# Altium schematic sheet UART_to_Micro_USB.SchDoc
size A4; Organization: Altium Limited; Address1: L3, 12a Rodborough Rd; Address2: Frenchs Forest; Address3: NSW; Address4: Australia 2086
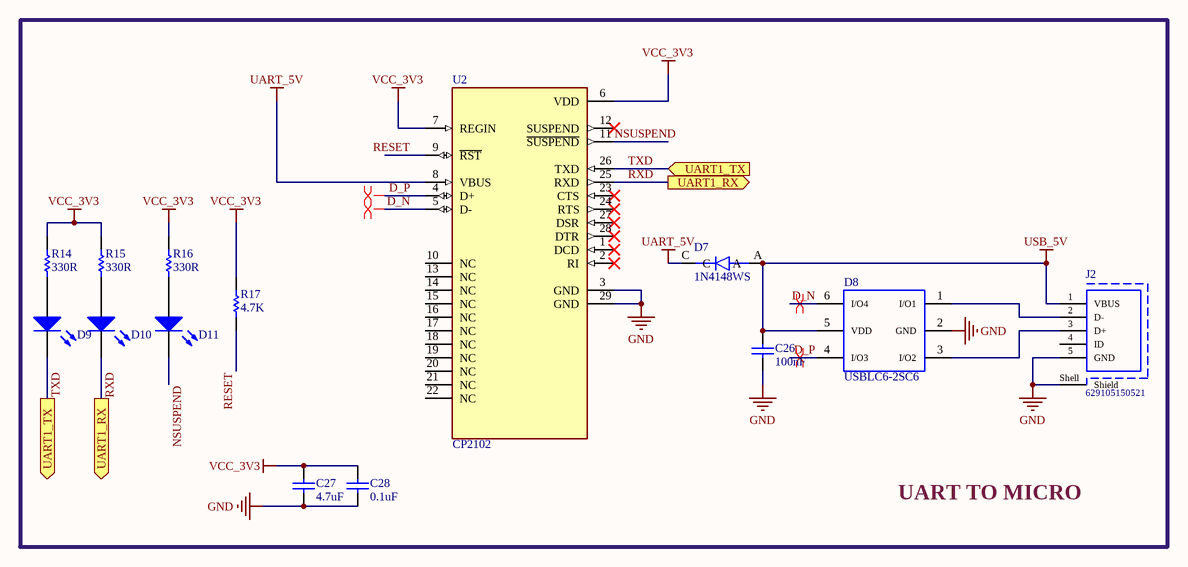
[diagram p0: UART_to_Micro_USB.SchDoc]

## Parts
C26  value 100nF  [CAP-SM-0805]  (hidden comment: Cap Non-Pol SMD)
C27  value 4.7uF  [CAP-SM-0805]  (hidden comment: Cap Non-Pol SMD)
C28  value 0.1uF  [CAP-SM-0805]  (hidden comment: Cap Non-Pol SMD)
D7  1N4148WS  [SODFL2512X100N]
D8  USBLC6-2SC6  [WE-TVS_SOT23-6L]
D9  LED SMD  [LED_0603_Blue]  (value not drawn)
D10  LED SMD  [LED_0603_Blue]  (value not drawn)
D11  LED SMD  [LED_0603_Blue]  (value not drawn)
J2  629105150521  [629105150521]
R14  value 330R  [RES-SM-0805]  (hidden comment: RESISTOR SMD)
R15  value 330R  [RES-SM-0805]  (hidden comment: RESISTOR SMD)
R16  value 330R  [RES-SM-0805]  (hidden comment: RESISTOR SMD)
R17  value 4.7K  [RES-SM-0805]  (hidden comment: RESISTOR SMD)
U2  CP2102  [QFN50P500X500X100-29N]

## Blocks framed on the sheet
UART TO MICRO: C26-C28 D7-D11 J2 R14-R17 U2

## Ports
UART1_RX (out), UART1_TX (in), UART1_TX (out)

## Nets
GND: C26.1 C27.1 C28.1 D8.2(GND) J2.5(GND) J2.Shell(Shield) U2.3(GND) U2.29(GND)
UART_5V: D7.C U2.8(VBUS)
USB_5V: C26.2 D7.A D8.5(VDD) J2.1(VBUS)
VCC_3V3: C27.2 C28.2 R14.2 R15.2 R16.2 R17.1 U2.6(VDD) U2.7(REGIN)
D_N: D8.6(I/O4) U2.5(D-)
D_P: D8.4(I/O3) U2.4(D+)
NSUSPEND: D11.2(K) U2.11(~{SUSPEND})
RESET: R17.2 U2.9(~{RST})
RXD: D10.2(K) U2.25(RXD) ; port UART1_RX
TXD: D9.2(K) U2.26(TXD) ; port UART1_TX
NetD8_1: D8.1(I/O1) J2.2(D-)
NetD8_3: D8.3(I/O2) J2.3(D+)
NetD9_1: D9.1(A) R14.1
NetD10_1: D10.1(A) R15.1
NetD11_1: D11.1(A) R16.1

Not connected (* = marked no-connect by the designer): J2 4(ID); U2 1(DCD)* 2(RI)* 10(NC) 12(SUSPEND)* 13(NC) 14(NC) 15(NC) 16(NC) 17(NC) 18(NC) 19(NC) 20(NC) 21(NC) 22(NC) 23(CTS)* 24(RTS)* 27(DSR)* 28(DTR)*

## Layout directives
differential pair: D_N, D_P

## Notes on the sheet
- Title
- Size:
- Date:
- A4
- Number:
- Time:
- Revision:
- Sheet
- of
- File:

## Library data of the parts
C26-C28 = Cap Non-Pol SMD: Capacitor
D7 = 1N4148WS: Diode Standard 75V 300mA (DC) Surface Mount SOD-323; MF: ON Semiconductor; Purchase-URL: https://pricing.snapeda.com/search/part/1N4148WS/?ref=eda; Value: *; Package: SOD-323FL-2 ON Semiconductor; Availability: In Stock; Price: None; MP: 1N4148WS
D8 = 824001: WE-TVS TVS Diode - High Speed Series, SOT23-6L, 4+1Channel, 5Vdc; Manufacturer: Wurth Elektronik; Reverse Breakdown Voltage min.: 6.2V; Channel: 4+1; Channel Input Capacitance: 1pF; Reverse Peak Pulse Current: 5A; Reverse Channel Leakage Current: 5uA; DC Operating Voltage: 5V; ComponentLink1Description: Manufacturer; ComponentLink1URL: http://www.we-online.de; ComponentLink2Description: Datasheet; ComponentLink2URL: https://www.we-online.com/catalog/datasheet/824001.pdf; Manufacturer Part Number: 824001; Published Date: April 2020; Size: SOT23-6L; Operating Temperature: -40 to +125degC; Mounting Technology: SMT; Packaging: Tape and Reel
D9-D11 = LED SMD: LED
J2 = 629105150521: Micro USB 2.0 Type B Receptacle WR-COM, Horizontal, SMT, with Pegs, High Current at Pin 1 & Pin 5; Rated Current: 3 A; Contact Resistance: 30 mOhm; Working Voltage: 30 VAC; ComponentLink1Description: Manufacturer; ComponentLink1URL: http://www.we-online.de; ComponentLink2Description: Datasheet; ComponentLink2URL: https://katalog.we-online.de/em/datasheet/629105150521.pdf; Part Number: 629105150521; Published Date: September 2018; Publisher: Wurth Elektronik; Orientation: Horizontal; Connector Type: Micro USB 2.0 Type B; Operating Temperature: -40 to 85 degC; Mounting Technology: SMT; Gender: Receptacle; Packaging: Tape and Reel
R14-R17 = RESISTOR SMD: Resistor
U2 = CP2102: CP2102N USB 2.0 to UART (RS232) Bridge Interface Evaluation Board; MF: Silicon Labs; Purchase-URL: https://pricing.snapeda.com/search/part/CP2102/?ref=eda; Package: WFQFN-20 Silicon Labs; Value: *; Check_prices: https://www.snapeda.com/parts/CP2102/Silicon+Labs/view-part/?ref=eda; SnapEDA_Link: https://www.snapeda.com/parts/CP2102/Silicon+Labs/view-part/?ref=snap; Availability: In Stock; Price: None; MP: CP2102